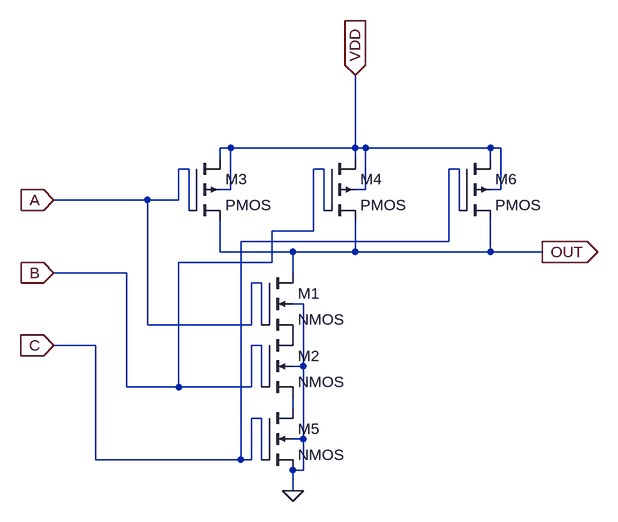
[diagram p0: schematic nand3.asc]
nand3.asc, the LTspice schematic file:
Version 4
SHEET 1 880 680
WIRE 96 32 80 32
WIRE 288 32 288 -80
WIRE 288 32 96 32
WIRE 304 32 288 32
WIRE 496 32 304 32
WIRE 512 32 496 32
WIRE 80 48 80 32
WIRE 288 48 288 32
WIRE 496 48 496 32
WIRE 32 64 16 64
WIRE 240 64 224 64
WIRE 448 64 432 64
WIRE 96 96 96 32
WIRE 96 96 80 96
WIRE 304 96 304 32
WIRE 304 96 288 96
WIRE 512 96 512 32
WIRE 512 96 496 96
WIRE -32 112 -176 112
WIRE 16 112 16 64
WIRE 16 112 -32 112
WIRE 32 128 32 64
WIRE 240 128 240 64
WIRE 448 128 448 64
WIRE 224 160 224 64
WIRE 224 160 160 160
WIRE 432 176 432 64
WIRE 432 176 112 176
WIRE 80 192 80 144
WIRE 192 192 80 192
WIRE 288 192 288 144
WIRE 288 192 192 192
WIRE 496 192 496 144
WIRE 496 192 288 192
WIRE 576 192 496 192
WIRE 160 208 160 160
WIRE 160 208 16 208
WIRE -64 224 -176 224
WIRE 192 224 192 192
WIRE 144 240 128 240
WIRE 208 272 192 272
WIRE -32 304 -32 112
WIRE 128 304 128 240
WIRE 128 304 -32 304
WIRE 144 304 144 240
WIRE -112 336 -176 336
WIRE 144 336 128 336
WIRE 208 368 208 272
WIRE 208 368 192 368
WIRE -64 400 -64 224
WIRE 16 400 16 208
WIRE 16 400 -64 400
WIRE 128 400 128 336
WIRE 128 400 16 400
WIRE 144 400 144 336
WIRE 192 432 192 416
WIRE 144 448 128 448
WIRE 208 480 208 368
WIRE 208 480 192 480
WIRE -112 512 -112 336
WIRE 112 512 112 176
WIRE 112 512 -112 512
WIRE 128 512 128 448
WIRE 128 512 112 512
WIRE 144 512 144 448
WIRE 208 528 208 480
WIRE 208 528 192 528
WIRE 192 560 192 528
FLAG -176 112 A
IOPIN -176 112 In
FLAG -176 224 B
IOPIN -176 224 In
FLAG 192 560 0
FLAG 576 192 OUT
IOPIN 576 192 Out
FLAG -176 336 C
IOPIN -176 336 In
FLAG 288 -80 VDD
IOPIN 288 -80 In
SYMBOL nmos4 144 224 R0
SYMATTR InstName M1
SYMATTR Value2 l=90n w=200n
SYMBOL nmos4 144 320 R0
SYMATTR InstName M2
SYMATTR Value2 l=90n w=200n
SYMBOL pmos4 32 48 R0
SYMATTR InstName M3
SYMATTR Value2 l=90n w=400n
SYMBOL pmos4 240 48 R0
SYMATTR InstName M4
SYMATTR Value2 l=90n w=400n
SYMBOL nmos4 144 432 R0
SYMATTR InstName M5
SYMATTR Value2 l=90n w=200n
SYMBOL pmos4 448 48 R0
SYMATTR InstName M6
SYMATTR Value2 l=90n w=400n

The netlist it stands for:
* nand3.asc
M1 OUT A P001 0 NMOS l=90n w=200n
M2 P001 B N001 0 NMOS l=90n w=200n
M3 VDD A OUT VDD PMOS l=90n w=400n
M4 VDD B OUT VDD PMOS l=90n w=400n
M5 N001 C 0 0 NMOS l=90n w=200n
M6 VDD C OUT VDD PMOS l=90n w=400n
.model NMOS NMOS
.model PMOS PMOS
.lib standard.mos
.backanno
.end